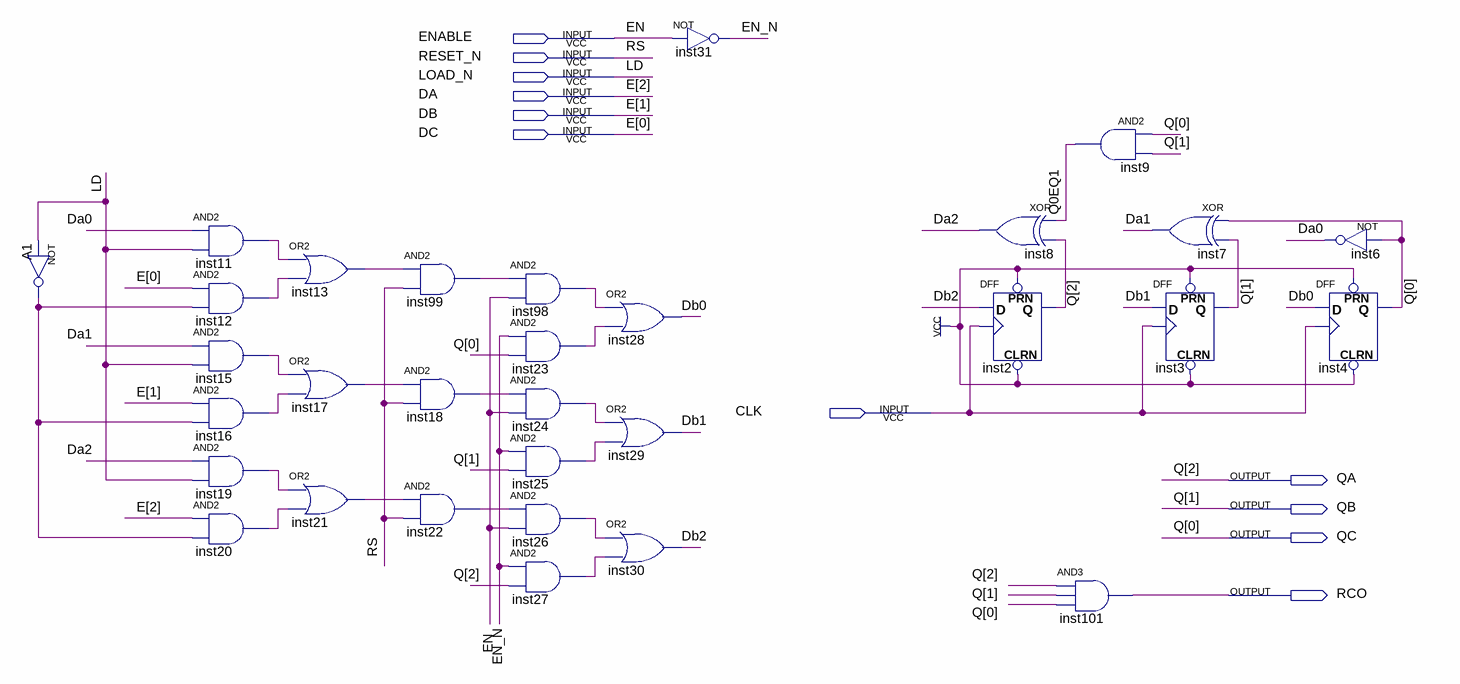
[diagram p0: schematic sheet]
// Quartus schematic Contador3Bits.bdf as structural Verilog: 31 symbols, 11 pins
module Contador3Bits (
  input  ENABLE,
  input  RESET_N,
  input  LOAD_N,
  input  DA,
  input  DB,
  input  DC,
  input  CLK,
  output QA,
  output QB,
  output QC,
  output RCO
);

  wire A1_out, Da0, Da1, Da2, Db0, Db1, Db2, EN_N, inst11_out, inst12_out, inst13_out, inst15_out,
       inst16_out, inst17_out, inst18_out, inst19_out, inst20_out, inst21_out, inst22_out, inst23_out,
       inst24_out, inst25_out, inst26_out, inst27_out, inst98_out, inst99_out, Q0EQ1;

  not A1 (A1_out, LOAD_N);
  and inst11 (inst11_out, Da0, LOAD_N);
  and inst12 (inst12_out, DC, A1_out);
  and inst15 (inst15_out, Da1, LOAD_N);
  and inst16 (inst16_out, DB, A1_out);
  and inst19 (inst19_out, Da2, LOAD_N);
  and inst20 (inst20_out, DA, A1_out);
  or inst13 (inst13_out, inst11_out, inst12_out);
  or inst17 (inst17_out, inst15_out, inst16_out);
  or inst21 (inst21_out, inst19_out, inst20_out);
  and inst99 (inst99_out, inst13_out, RESET_N);
  and inst18 (inst18_out, inst17_out, RESET_N);
  and inst22 (inst22_out, inst21_out, RESET_N);
  and inst98 (inst98_out, inst99_out, ENABLE);
  and inst23 (inst23_out, EN_N, QC);
  and inst24 (inst24_out, inst18_out, ENABLE);
  and inst25 (inst25_out, EN_N, QB);
  and inst26 (inst26_out, inst22_out, ENABLE);
  and inst27 (inst27_out, EN_N, QA);
  or inst28 (Db0, inst98_out, inst23_out);
  or inst29 (Db1, inst24_out, inst25_out);
  or inst30 (Db2, inst26_out, inst27_out);
  not inst31 (EN_N, ENABLE);
  xor inst8 (Da2, Q0EQ1, QA);
  DFF inst2 (.CLRN(1'b1), .CLK(CLK), .D(Db2), .PRN(1'b1), .Q(QA));
  and inst9 (Q0EQ1, QC, QB);
  and inst101 (RCO, QA, QB, QC);
  xor inst7 (Da1, QC, QB);
  DFF inst3 (.CLRN(1'b1), .CLK(CLK), .D(Db1), .PRN(1'b1), .Q(QB));
  not inst6 (Da0, QC);
  DFF inst4 (.CLRN(1'b1), .CLK(CLK), .D(Db0), .PRN(1'b1), .Q(QC));

  // Other names for the same wires on the sheet: E[2:0] = {DA, DB, DC}; EN = ENABLE; LD = LOAD_N;
  //   Q[2:0] = {QA, QB, QC}; RS = RESET_N
endmodule
